# EAGLE schematic CrystalVideo_transmitter_schematic (EAGLE 7.7.0)
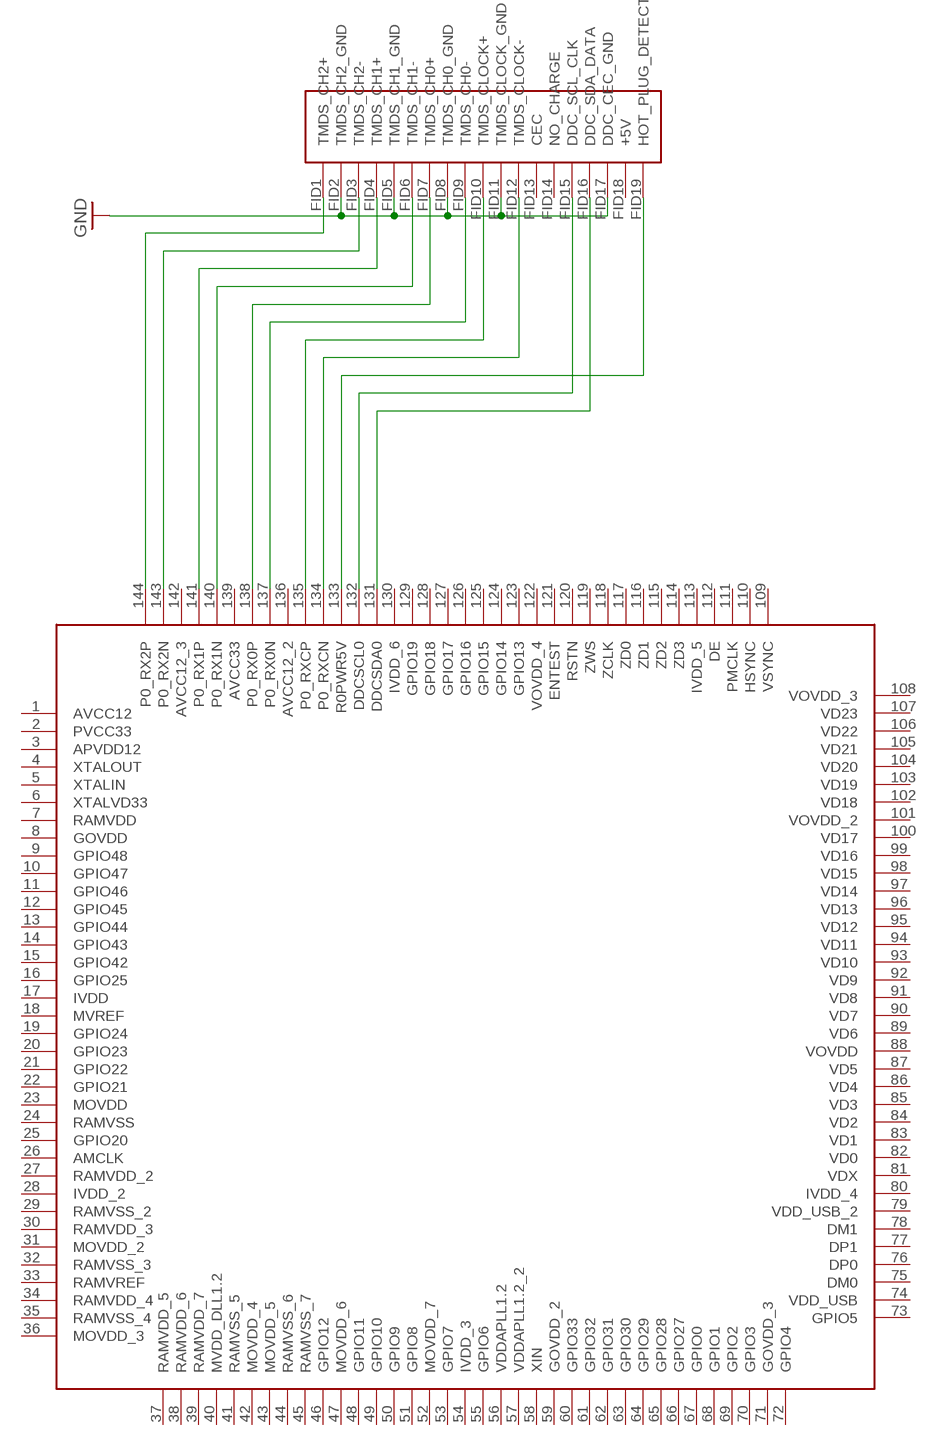
[diagram p0: schematic, sheet 1]

## Parts
U$1  HDMI_MOLEX  [HDMI_MOLEX]
U$2  IT9919  [QFP145P40_IT9910_8X8]

## Nets
GND: U$1.FID2(TMDS_CH2_GND) U$1.FID5(TMDS_CH1_GND) U$1.FID8(TMDS_CH0_GND) U$1.FID11(TMDS_CLOCK_GND) U$1.FID17(DDC_CEC_GND)
N$1: U$1.FID9(TMDS_CH0-) U$2.137(P0_RX0N)
N$2: U$1.FID7(TMDS_CH0+) U$2.138(P0_RX0P)
N$3: U$1.FID6(TMDS_CH1-) U$2.140(P0_RX1N)
N$4: U$1.FID4(TMDS_CH1+) U$2.141(P0_RX1P)
N$5: U$1.FID3(TMDS_CH2-) U$2.143(P0_RX2N)
N$6: U$1.FID1(TMDS_CH2+) U$2.144(P0_RX2P)
N$7: U$1.FID12(TMDS_CLOCK-) U$2.134(P0_RXCN)
N$8: U$1.FID10(TMDS_CLOCK+) U$2.135(P0_RXCP)
N$9: U$1.FID19(HOT_PLUG_DETECT) U$2.133(R0PWR5V)
N$10: U$1.FID15(DDC_SCL_CLK) U$2.132(DDCSCL0)
N$11: U$1.FID16(DDC_SDA_DATA) U$2.131(DDCSDA0)
Unconnected: U$1.FID13(CEC) U$1.FID14(NO_CHARGE) U$1.FID18(+5V) U$2.1(AVCC12) U$2.2(PVCC33) U$2.3(APVDD12) U$2.4(XTALOUT) U$2.5(XTALIN) U$2.6(XTALVD33) U$2.7(RAMVDD) U$2.8(GOVDD) U$2.9(GPIO48) U$2.10(GPIO47) U$2.11(GPIO46) U$2.12(GPIO45) U$2.13(GPIO44) U$2.14(GPIO43) U$2.15(GPIO42) U$2.16(GPIO25) U$2.17(IVDD) U$2.18(MVREF) U$2.19(GPIO24) U$2.20(GPIO23) U$2.21(GPIO22) U$2.22(GPIO21) U$2.23(MOVDD) U$2.24(RAMVSS) U$2.25(GPIO20) U$2.26(AMCLK) U$2.27(RAMVDD_2) U$2.28(IVDD_2) U$2.29(RAMVSS_2) U$2.30(RAMVDD_3) U$2.31(MOVDD_2) U$2.32(RAMVSS_3) U$2.33(RAMVREF) U$2.34(RAMVDD_4) U$2.35(RAMVSS_4) U$2.36(MOVDD_3) U$2.37(RAMVDD_5) U$2.38(RAMVDD_6) U$2.39(RAMVDD_7) U$2.40(MVDD_DLL1.2) U$2.41(RAMVSS_5) U$2.42(MOVDD_4) U$2.43(MOVDD_5) U$2.44(RAMVSS_6) U$2.45(RAMVSS_7) U$2.46(GPIO12) U$2.47(MOVDD_6) U$2.48(GPIO11) U$2.49(GPIO10) U$2.50(GPIO9) U$2.51(GPIO8) U$2.52(MOVDD_7) U$2.53(GPIO7) U$2.54(IVDD_3) U$2.55(GPIO6) U$2.56(VDDAPLL1.2) U$2.57(VDDAPLL1.2_2) U$2.58(XIN) U$2.59(GOVDD_2) U$2.60(GPIO33) U$2.61(GPIO32) U$2.62(GPIO31) U$2.63(GPIO30) U$2.64(GPIO29) U$2.65(GPIO28) U$2.66(GPIO27) U$2.67(GPIO0) U$2.68(GPIO1) U$2.69(GPIO2) U$2.70(GPIO3) U$2.71(GOVDD_3) U$2.72(GPIO4) U$2.73(GPIO5) U$2.74(VDD_USB) U$2.75(DM0) U$2.76(DP0) U$2.77(DP1) U$2.78(DM1) U$2.79(VDD_USB_2) U$2.80(IVDD_4) U$2.81(VDX) U$2.82(VD0) U$2.83(VD1) U$2.84(VD2) U$2.85(VD3) U$2.86(VD4) U$2.87(VD5) U$2.88(VOVDD) U$2.89(VD6) U$2.90(VD7) U$2.91(VD8) U$2.92(VD9) U$2.93(VD10) U$2.94(VD11) U$2.95(VD12) U$2.96(VD13) U$2.97(VD14) U$2.98(VD15) U$2.99(VD16) U$2.100(VD17) U$2.101(VOVDD_2) U$2.102(VD18) U$2.103(VD19) U$2.104(VD20) U$2.105(VD21) U$2.106(VD22) U$2.107(VD23) U$2.108(VOVDD_3) U$2.109(VSYNC) U$2.110(HSYNC) U$2.111(PMCLK) U$2.112(DE) U$2.113(IVDD_5) U$2.114(ZD3) U$2.115(ZD2) U$2.116(ZD1) U$2.117(ZD0) U$2.118(ZCLK) U$2.119(ZWS) U$2.120(RSTN) U$2.121(ENTEST) U$2.122(VOVDD_4) U$2.123(GPIO13) U$2.124(GPIO14) U$2.125(GPIO15) U$2.126(GPIO16) U$2.127(GPIO17) U$2.128(GPIO18) U$2.129(GPIO19) U$2.130(IVDD_6) U$2.136(AVCC12_2) U$2.139(AVCC33) U$2.142(AVCC12_3)

## Library data of the parts
U$1 = CrystalVideo:HDMI_MOLEX
U$2 = CrystalVideo:IT9919: ITE IT9199-N H.264 Encoder SOC